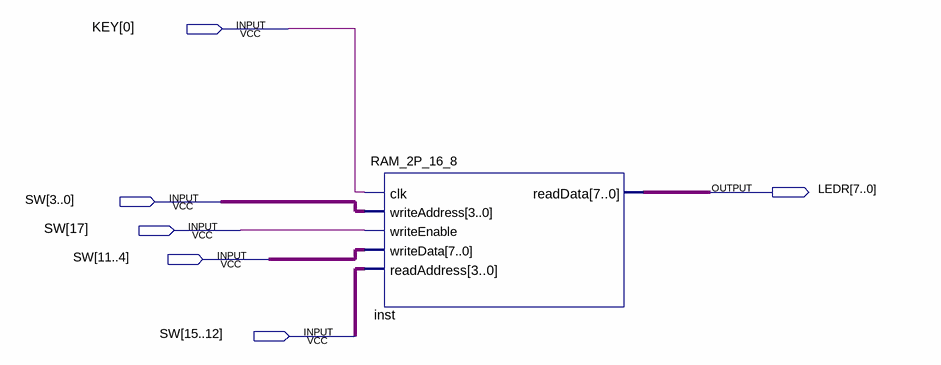
[diagram p0: schematic sheet]
// Quartus schematic RAM_2P_Demo.bdf as structural Verilog: 1 symbols, 6 pins
module RAM_2P_Demo (
  input  [0:0] KEY,
  input  [17:0] SW,
  output [7:0] LEDR
);

  RAM_2P_16_8 inst (
    .clk(KEY[0]), .writeAddress(SW[3:0]), .writeEnable(SW[17]), .writeData(SW[11:4]),
    .readAddress(SW[15:12]), .readData(LEDR));
endmodule
